# EAGLE design stm32f0driver1 (EAGLE 6.5.0)
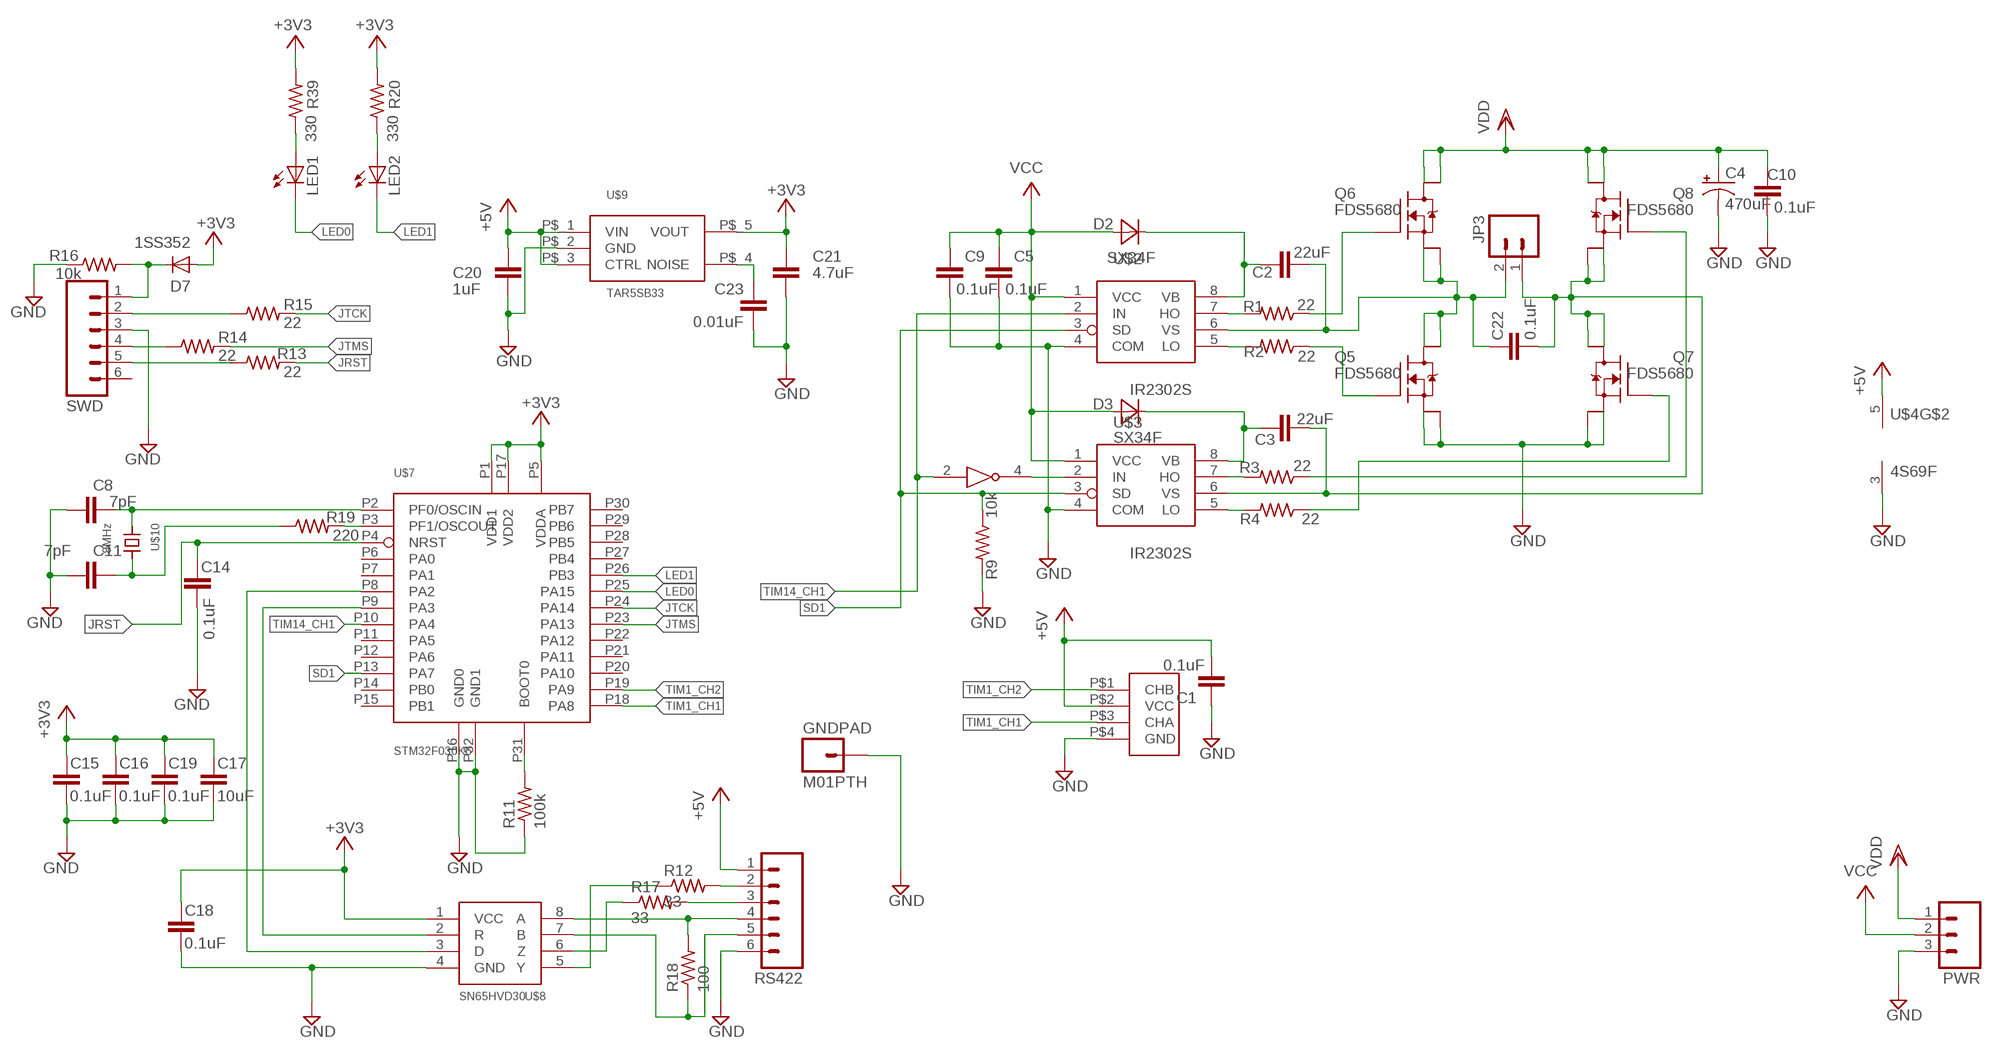
[diagram p0: schematic, sheet 1]

## Parts
C1  0.1uF  C-EUC0603  [C0603]
C2  22uF  C-EUC3225  [C3225]
C3  22uF  C-EUC3225  [C3225]
C4  470uF  CPOL-USE5-10.5  [E5-10,5]
C5  0.1uF  C-EUC0603  [C0603]
C8  7pF  C-EUC0603  [C0603]
C9  0.1uF  C-EUC0603  [C0603]
C10  0.1uF  C-EUC0603  [C0603]
C11  7pF  C-EUC0603  [C0603]
C14  0.1uF  C-EUC1608  [C1608]
C15  0.1uF  C-EUC1608  [C1608]
C16  0.1uF  C-EUC1608  [C1608]
C17  10uF  C-EUC3216  [C3216]
C18  0.1uF  C-EUC1608  [C1608]
C19  0.1uF  C-EUC1608  [C1608]
C20  1uF  C-EUC2012  [C2012]
C21  4.7uF  C-EUC2012  [C2012]
C22  0.1uF  C-EUC0603  [C0603]
C23  0.01uF  C-EUC0603  [C0603]
D2  SX34F  MBRA340T3  [SMA]
D3  SX34F  MBRA340T3  [SMA]
D7  1SS352  DIODESOD  [SOD-323]
GNDPAD  M01PTH  [1X01]
JP3  M02PTH3  [1X02_LONGPADS]
LED1  LED0603  [LED-0603]
LED2  LED0603  [LED-0603]
PWR  M03LONGPADS  [1X03_LONGPADS]
Q5  FDS5680  [1206-8CHIP-FET]
Q6  FDS5680  [1206-8CHIP-FET]
Q7  FDS5680  [1206-8CHIP-FET]
Q8  FDS5680  [1206-8CHIP-FET]
R1  22  R-US_R0603  [R0603]
R2  22  R-US_R0603  [R0603]
R3  22  R-US_R0603  [R0603]
R4  22  R-US_R0603  [R0603]
R9  10k  R-US_R0603  [R0603]
R11  100k  R-US_R0603  [R0603]
R12  33  R-US_R0603  [R0603]
R13  22  R-US_R0603  [R0603]
R14  22  R-US_R0603  [R0603]
R15  22  R-US_R0603  [R0603]
R16  10k  R-US_R0603  [R0603]
R17  33  R-US_R0603  [R0603]
R18  100  R-US_R0603  [R0603]
R19  220  R-US_R0603  [R0603]
R20  330  R-US_R0603  [R0603]
R39  330  R-US_R0603  [R0603]
RS422  M06SIP  [1X06]
SWD  M06SIP  [1X06]
U$1  HEDS9701-C54  [HEDS9701]
U$2  IR2302S  [SO8]
U$3  IR2302S  [SO8]
U$4  4S69F  [SOT23-5]
U$7  STM32F030K6  [LQFP32]
U$8  SN65HVD30  [SO8]
U$9  TAR5SB33  [TAR5SB33]
U$10  8MHz  NX5032GA  [SMD5032]

## Nets
+3V3: C15.1 C16.1 C17.1 C18.1 C19.1 C21.1 D7.2(A) R20.2 R39.2 U$7.P1(VDD1) U$7.P5(VDDA) U$7.P17(VDD2) U$8.1(VCC) U$9.P$_5(VOUT)
+5V: C1.2 C20.1 RS422.1 U$1.P$2(VCC) U$4.5(V+) U$9.P$_1(VIN) U$9.P$_3(CTRL)
GND: C1.1 C4.- C5.2 C8.2 C9.2 C10.2 C11.2 C14.2 C15.2 C16.2 C17.2 C18.2 C19.2 C20.2 C21.2 C23.2 GNDPAD.1 PWR.3 Q5.1(S) Q5.2(S1) Q5.3(S2) Q7.1(S) Q7.2(S1) Q7.3(S2) R9.2 R11.1 R16.1 RS422.6 SWD.3 U$1.P$4(GND) U$2.4(COM) U$3.4(COM) U$4.3(V-) U$7.P16(GND0) U$7.P32(GND1) U$8.4(GND) U$9.P$_2(GND)
JRST: C14.1 R13.2 U$7.P4(NRST)
JTCK: R15.2 U$7.P24(PA14)
JTMS: R14.2 U$7.P23(PA13)
LED0: LED1.C U$7.P25(PA15)
LED1: LED2.C U$7.P26(PB3)
N$2: C3.1 D3.C U$3.8(VB)
N$4: C3.2 C22.2 JP3.1 Q7.5(D) Q7.6(D1) Q7.7(D2) Q7.8(D3) Q8.1(S) Q8.2(S1) Q8.3(S2) U$3.6(VS)
N$8: C2.2 C22.1 JP3.2 Q5.5(D) Q5.6(D1) Q5.7(D2) Q5.8(D3) Q6.1(S) Q6.2(S1) Q6.3(S2) U$2.6(VS)
N$9: C2.1 D2.C U$2.8(VB)
N$12: R1.2 U$2.7(HO)
N$20: R19.2 U$7.P3(PF1/OSCOUT)
N$21: LED1.A R39.1
N$23: R2.2 U$2.5(LO)
N$24: R3.2 U$3.7(HO)
N$25: R4.2 U$3.5(LO)
N$26: Q6.4(G) R1.1
N$27: Q8.4(G) R3.1
N$28: C11.1 R19.1 U$10.P2
N$29: Q7.4(G) R4.1
N$30: C8.1 U$7.P2(PF0/OSCIN) U$10.P1
N$31: D7.1(C) R16.2 SWD.1
N$32: LED2.A R20.1
N$33: U$3.2(IN) U$4.4
N$35: C23.1 U$9.P$_4(NOISE)
N$36: Q5.4(G) R2.1
N$38: R11.2 U$7.P31(BOOT0)
N$39: R15.1 SWD.2
N$40: R14.1 SWD.4
N$41: R13.1 SWD.5
N$43: R12.2 RS422.2
N$44: R17.2 RS422.3
N$45: R12.1 U$8.5(Y)
N$46: R18.2 RS422.4 U$8.8(A)
N$47: R18.1 RS422.5 U$8.7(B)
N$48: R17.1 U$8.6(Z)
N$50: U$7.P8(PA2) U$8.3(D)
N$51: U$7.P9(PA3) U$8.2(R)
SD1: R9.1 U$2.3(SD) U$3.3(SD) U$7.P13(PA7)
TIM1_CH1: U$1.P$3(CHA) U$7.P18(PA8)
TIM1_CH2: U$1.P$1(CHB) U$7.P19(PA9)
TIM14_CH1: U$2.2(IN) U$4.2 U$7.P10(PA4)
VCC: C5.1 C9.1 D2.A D3.A PWR.2 U$2.1(VCC) U$3.1(VCC)
VDD: C4.+ C10.1 PWR.1 Q6.5(D) Q6.6(D1) Q6.7(D2) Q6.8(D3) Q8.5(D) Q8.6(D1) Q8.7(D2) Q8.8(D3)
Unconnected: SWD.6 U$7.P6(PA0) U$7.P7(PA1) U$7.P11(PA5) U$7.P12(PA6) U$7.P14(PB0) U$7.P15(PB1) U$7.P20(PA10) U$7.P21(PA11) U$7.P22(PA12) U$7.P27(PB4) U$7.P28(PB5) U$7.P29(PB6) U$7.P30(PB7)

## Library data of the parts
C1-C3 C5 C8-C11 C14-C23 = rcl:C-EU: CAPACITOR, European symbol
C4 = rcl:CPOL-US: POLARIZED CAPACITOR, American symbol
D2 D3 = diode:MBRA340T3: Surface Mount Schottky Power Rectifier Source: http://www.onsemi.com/pub_link/Collateral/MBRA340T3-D.PDF
D7 = SparkFun:DIODE: Diode These are standard reverse protection diodes and small signal diodes. SMA package can handle up to about 1A. SOD-323 can handle about 200mA. What the SOD-323 package when ordering, there are some mfgs out there that are 5-pin packages.
GNDPAD = SparkFun:M01: Header 1 Standard 1-pin 0.1" header. Use with straight break away headers (SKU : PRT-00116), right angle break away headers (PRT-00553), swiss pins (PRT-00743), machine pins (PRT-00117), and female headers (PRT-00115).
JP3 = SparkFun:M02: Header 2 Standard 2-pin 0.1" header. Use with straight break away headers (SKU : PRT-00116), right angle break away headers (PRT-00553), swiss pins (PRT-00743), machine pins (PRT-00117), and female headers (PRT-00115). Molex polarized connector foot print use with SKU : PRT-08233 with associated crimp pins and housings.
LED1 LED2 = SparkFun:LED: LEDs Standard schematic elements and footprints for 5mm, 3mm, 1206, and 0603 sized LEDs. 5mm - Spark Fun Electronics SKU : COM-00529 (and others)
PWR = SparkFun:M03: Header 3 Standard 3-pin 0.1" header. Use with straight break away headers (SKU : PRT-00116), right angle break away headers (PRT-00553), swiss pins (PRT-00743), machine pins (PRT-00117), and female headers (PRT-00115). Molex polarized connector foot print use with SKU : PRT-08232 with associated crimp pins and housings.
Q5-Q8 = mizdevice:FDS5680: Single N-Channel 30-V (D-S) MOSFET Source: http://akizukidenshi.com/download/fds5680.pdf
R1-R4 R9 R11-R20 R39 = rcl:R-US_: RESISTOR, American symbol
RS422 SWD = SparkFun:M06: Header 6 Standard 6-pin 0.1" header. Use with straight break away headers (SKU : PRT-00116), right angle break away headers (PRT-00553), swiss pins (PRT-00743), machine pins (PRT-00117), and female headers (PRT-00115). Molex polarized connector foot print use with SKU : PRT-08094 with associated crimp pins and housings. NOTES ON THE VARIANTS LOCK and LOCK_LONGPADS... This footprint was designed to help hold the alignment of a through-hole component (i.e. 6-pin header) while soldering it into place. You may notice that each hole has been shifted either up or down by 0.005 of an inch from it's more standard position (which is a perfectly straight line). This slight alteration caused the pins (the squares in the middle) to touch the edges of the holes. Because they are alternating, it causes a "brace" to hold the component in place. 0.005 has proven to be the perfect amount of "off-center" position when using our standard breakaway headers. Although looks a little odd when you look at the bare footprint, once you have a header in there, the alteration is very hard to notice. Also, if you push a header all the way into place, it is covered up entirely on the bottom side. This idea of altering the position of holes to aid alignment will be further integrated into the Sparkfun Library for other footprints. It can help hold any component with 3 or more connection pins.
U$1 = mizdevice:HEDS9701-C54: Avago Technology HEDS-9701 2ch Optical Encorder #C54 CPR100
U$2 U$3 = mizdevice:IR2302S: IR2302 Half Bridge Driver
U$4 = mizdevice:4S69F
U$7 = mizdevice:STM32F030K6: STMicro ARM Cortex-M0 Microcontroller STM32F030 LQFP32Pin
U$8 = mizdevice:SN65HVD30
U$9 = mizdevice:TAR5SB33: Toshiba TAR5SB33 3.3V Lowdrop Reg
U$10 = mizdevice:NX5032GA: NDK Crystal Units NX5032GA SMD5.0x 3.2mm

## Board
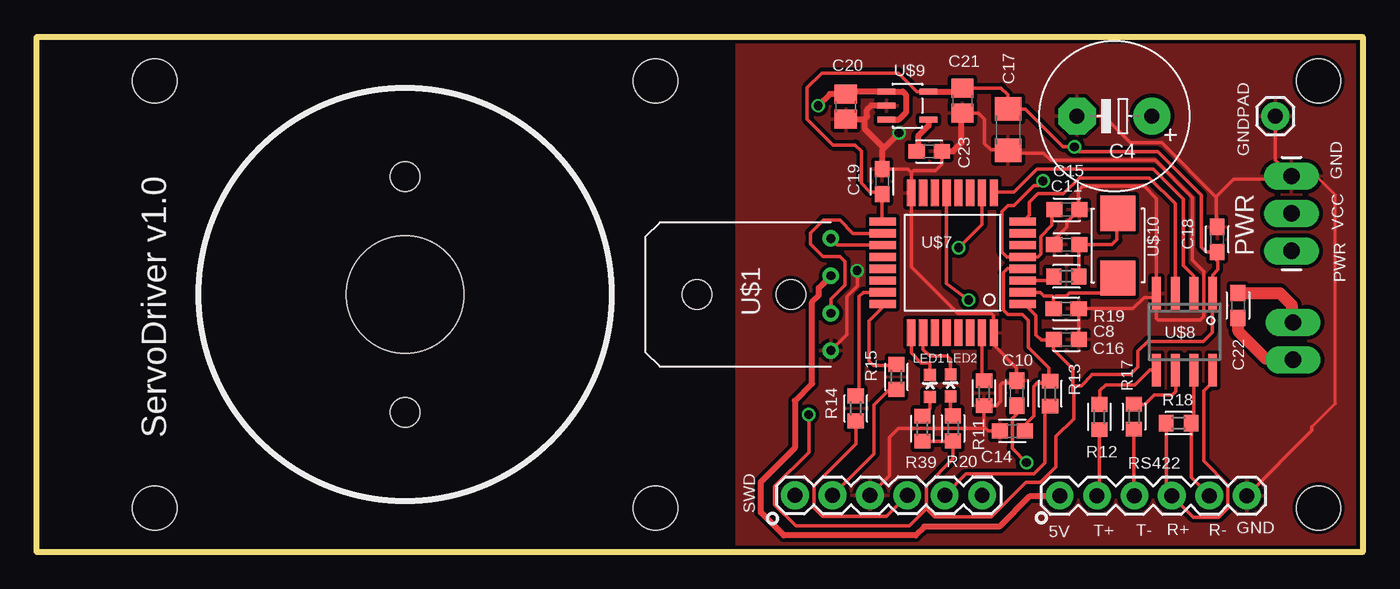
[diagram p1: board, top side]
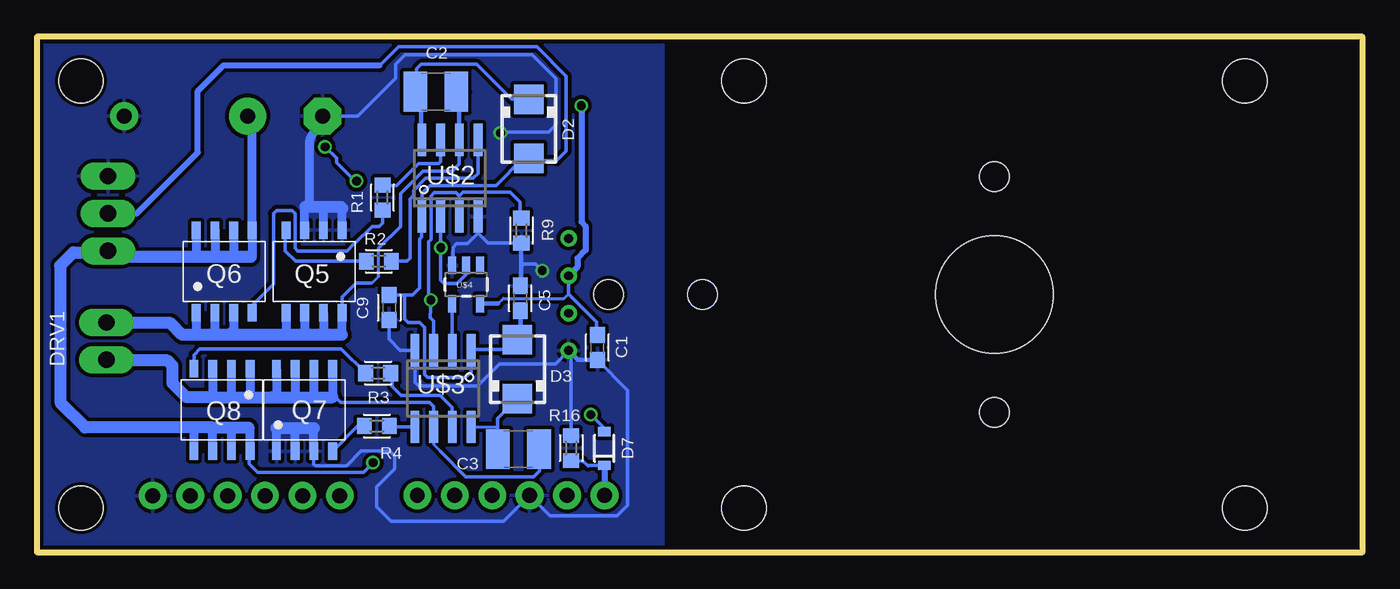
[diagram p2: board, bottom side, seen from below]

Size 90 x 35 mm. Coordinates in mm from the lower left corner, seen from the top.
Outline: 0,0 0,35 90,35 90,0 0,0
Copper layers (1*16): Top 0.035mm / dielectric 1.5mm / Bottom 0.035mm
Design rules "Fusion_eagle_rule_v1.1": minimum track width 6mil, minimum drill 12mil, track to track 6mil, track to pad 6mil, pad to pad 6mil, via to via 6mil, smd to smd 0mil, copper to edge 10mil, drill to drill 10mil, minimum pad ring 10mil, minimum via ring 6mil, stop-mask expansion 2mil, vias tented up to drill 100mil, thermal gap 10mil
Holes 3 mm at 8,3 87,3 87,32 8,32 42,32 42,3
Holes 8 mm at 25,17.5
Holes 2 mm at 25,25.5 25,9.5

### Footprints (pad centres in the part's own frame; a part is rotated, then mirrored left to right if it is on the bottom)
C0603 = smd 1.1 x 1: 1 -0.85,0; 2 0.85,0
C3225 = smd 1.6 x 2.7: 1 -1.4,0; 2 1.4,0
E5-10,5 = drill 1.016 pad 2.54: + -2.54,0 | drill 1.016 pad 2.54 octagon: - 2.54,0
C1608 = smd 1.1 x 1: 1 -0.85,0; 2 0.85,0
C3216 = smd 1.6 x 1.8: 1 -1.4,0; 2 1.4,0
C2012 = smd 1.3 x 1.5: 1 -0.85,0; 2 0.85,0
SMA = smd 2 x 2: A 2,0; C -2,0
SOD-323 = smd 0.63 x 0.83: 1 -1.15,0; 2 1.15,0
1X01 = drill 1.016 pad 1.88: 1 0,0
1X02_LONGPADS = drill 1.118 pad 1.88 long: 1 0,0; 2 2.54,0
LED-0603 = smd 0.8 x 0.8: A 0,-0.75; C 0,0.75
1X03_LONGPADS = drill 1.118 pad 1.88 long: 1 0,0; 2 2.54,0; 3 5.08,0
1206-8CHIP-FET = smd 0.6 x 1.2: 1 -1.905,-2.8; 2 -0.635,-2.8; 3 0.635,-2.8; 4 1.905,-2.8; 5 1.905,2.8; 6 0.635,2.8; 7 -0.635,2.8; 8 -1.905,2.8
R0603 = smd 1 x 1.1: 1 -0.85,0; 2 0.85,0
1X06 = drill 1.016 pad 1.88: 1 0,0; 2 2.54,0; 3 5.08,0; 4 7.62,0; 5 10.16,0; 6 12.7,0
HEDS9701 = drill 0.6: P$1 9.1,3.81; P$2 9.1,1.27; P$3 9.1,-1.27; P$4 9.1,-3.81 | hole 2: 0,0; 6.4,0
SO8 = smd 0.6 x 2.2: 1 -1.905,-2.6; 2 -0.635,-2.6; 3 0.635,-2.6; 4 1.905,-2.6; 5 1.905,2.6; 6 0.635,2.6; 7 -0.635,2.6; 8 -1.905,2.6
SOT23-5 = smd 0.55 x 1.2: 1 -0.95,-1.3; 2 0,-1.3; 3 0.95,-1.3; 4 0.95,1.3; 5 -0.95,1.3
LQFP32 = smd 0.56 x 1.8: P1 -2.8,-4.75; P2 -2,-4.75; P3 -1.2,-4.75; P4 -0.4,-4.75; P5 0.4,-4.75; P6 1.2,-4.75; P7 2,-4.75; P8 2.8,-4.75; P17 2.8,4.75; P18 2,4.75; P19 1.2,4.75; P20 0.4,4.75; P21 -0.4,4.75; P22 -1.2,4.75; P23 -2,4.75; P24 -2.8,4.75 | smd 1.8 x 0.56: P9 4.75,-2.8; P10 4.75,-2; P11 4.75,-1.2; P12 4.75,-0.4; P13 4.75,0.4; P14 4.75,1.2; P15 4.75,2; P16 4.75,2.8; P25 -4.75,2.8; P26 -4.75,2; P27 -4.75,1.2; P28 -4.75,0.4; P29 -4.75,-0.4; P30 -4.75,-1.2; P31 -4.75,-2; P32 -4.75,-2.8
TAR5SB33 = smd 1.2 x 0.4: P$_1 -1.425,0.95; P$_2 -1.425,0; P$_3 -1.425,-0.95; P$_4 1.425,-0.95; P$_5 1.425,0.95
SMD5032 = smd 2.4 x 2.4: P1 2.2,0; P2 -2.2,0

### Placement (x,y rotation side)
C1  51.94,13.9 90 bottom
C2  62.91,31.28 0 bottom
C3  57.31,7 0 bottom
C4  73.15,29.61 180 top
C5  57.18,17.24 90 bottom
C8  69.87,16.54 0 top
C9  66.08,16.61 270 bottom
C10  66.53,10.8 90 top
C11  69.91,20.89 180 top
C14  66.22,8.23 180 top
C15  69.92,23.26 0 top
C16  69.88,14.44 0 top
C17  65.93,28.69 270 top
C18  80.12,21.24 90 top
C19  57.38,25.17 90 top
C20  54.91,30.25 270 top
C21  62.83,30.67 270 top
C22  81.53,16.75 270 top
C23  60.58,27.22 0 top
D2  56.61,28.75 270 bottom
D3  57.37,12.42 90 bottom
D7  51.48,7.04 90 bottom
GNDPAD  84.07,29.61 0 top
JP3  85.27,13.06 90 bottom
LED1  60.63,11.29 0 top
LED2  62.03,11.32 0 top
PWR  85.17,20.46 90 top
Q5  71.18,19.06 180 bottom
Q6  77.28,19.06 0 bottom
Q7  71.83,9.66 0 bottom
Q8  77.43,9.66 180 bottom
R1  66.53,24.08 90 bottom
R2  66.78,19.76 0 bottom
R3  66.83,12.16 0 bottom
R4  66.92,8.57 0 bottom
R9  57.11,21.84 270 bottom
R11  64.3,10.8 90 top
R12  72.12,9.18 270 top
R13  68.79,10.76 90 top
R14  55.59,9.76 90 top
R15  58.35,11.9 90 top
R16  53.73,7.06 270 bottom
R17  74.47,9.2 270 top
R18  77.51,8.76 180 top
R19  69.89,18.73 180 top
R20  62.19,8.41 270 top
R39  60.11,8.39 270 top
RS422  69.43,3.84 0 top
SWD  51.47,3.86 0 top
U$1  44.8,17.5 0 top
U$2  61.96,25.39 0 bottom
U$3  62.43,11.11 180 bottom
U$4  60.85,18.18 180 bottom
U$7  62.16,19.65 90 top
U$8  77.91,14.97 180 top
U$9  59.1,30.33 0 top
U$10  73.38,20.82 270 top

### Tracks (layer width: path | path; a pad name or v marks a point on that pad's centre or on a via)
+3V3  (via drill 0.6)
  Top 0.254: U$7.P1 67.04,16.85 67.83,16.06 67.83,14.76 68.18,14.41 69,14.41 C16.1 69.02,13.78 70.34,12.46 70.34,11.28 | C15.1 68.9,23.09 68.9,22.2 68.15,21.45 68.15,20.24 67.96,20.05 U$7.P5 65.84,20.05 65.52,20.37 65.52,23.14 65.92,23.54 66.33,23.54 67.69,24.9 67.99,24.9 v68.3,25.21 68.28,25.19 | C21.1 65.45,31.52 65.9,31.07 65.9,30.12 C17.1 67.11,30.09 69.65,27.55 70.41,27.55 v70.44,27.52 70.76,27.2 76.09,27.2 79.05,24.24 79.05,20.73 79.39,20.39 C18.1 80.03,19.86 80.16,19.73 80.16,19.18 79.81,18.84 U$8.1 79.78,17.54 79.78,14.91 79.18,14.31 75.4,14.31 74.74,13.65 74.74,12.58 74.22,12.06 71.63,12.06 71.63,12.02 70.89,11.28 70.34,11.28 | U$9.P$_5 59.75,31.28 58.49,32.54 53.3,32.54 52.29,31.53 52.29,29.42 54.05,27.66 55.54,27.66 55.96,27.24 55.96,25.06 56.56,24.46 57.24,24.46 C19.1 | 57.23,24.47 C19.1 | C19.1 57.38,22.48 U$7.P17 | R39.2 62.17,7.54 R20.2 62.19,6.32 60.39,4.52 60.39,2.95 | 70.34,11.28 70.34,10.85 70.38,10.81 70.38,9.06 69.18,7.86 69.18,5.8 68.11,4.73 67.13,4.73 64.81,2.41 60.93,2.41 60.39,2.95 | 60.39,2.95 59.23,1.79 51.52,1.79 50.08,3.23 50.08,4.47 52.4,6.79 v52.4,9.34
  Top 0.406: U$9.P$_5 62.59,31.28 C21.1
  Bottom 0.254: 51.48,8.21 51.48,8.42 v52.4,9.34 | v68.3,25.21 68.4,25.21 69.64,26.45 69.64,26.77 v70.44,27.52
  Bottom 0.305: D7.2 51.48,8.21
+5V  (via drill 0.6)
  Top 0.254: C20.1
  Top 0.406: RS422.1 69.43,3.78 67.38,3.78 65.33,1.73 60.25,1.73 59.65,1.13 50.71,1.13 49.14,2.7 49.14,4.76 51.46,7.08 51.46,10.28 52.63,11.45 52.63,16.99 53.08,17.44 53.08,17.95 U$1.P$2 | C20.1 53.83,31.11 v53.04,30.32 | C20.1 55.09,31.28 U$9.P$_1 58.79,31.28 58.99,31.08 58.99,29.84 58.53,29.38 U$9.P$_3
  Bottom 0.2: 58.7,16.88 58.68,16.88 58.32,17.24 54.2,17.24 53.9,17.54
  Bottom 0.254: U$1.P$2 53.9,17.54 52,15.64 52,14.81 C1.2
  Bottom 0.305: U$4.5 58.7,16.88
  Bottom 0.406: v53.04,30.32 53.04,22.44 52.74,22.14 52.74,20.51 53.3,19.95 53.3,19.37 U$1.P$2
GND  (via drill 0.6)
  Top 0.2: 86.55,8.5 88.15,10.1 88.15,24.25 87.02,25.39 85.33,25.39 PWR.3
  Top 0.254: C16.2 C8.2 74.4,16.54 75.17,17.31 75.75,17.31 U$8.4 | C11.2 69.06,21.23 69.92,22.09 69.92,22.41 C15.2 70.7,23.33 70.7,24.54 71.01,24.85 75.17,24.85 76,24.02 U$8.4 | 54.97,29.46 C20.2 | C21.2 63.91,29.82 64.33,29.4 64.33,27.75 64.75,27.33 65.89,27.33 C17.2 66.12,27.1 68.34,27.1 68.83,26.61 75.91,26.61 78.43,24.09 78.43,19.83 79.21,19.05 79.21,16.01 78.98,15.78 76.11,15.78 76,15.88 U$8.4 | 57.41,26.05 C19.2 59.12,26.01 59.36,25.77 | 59.36,25.77 U$7.P16 59.36,19.37 62.52,16.21 64.79,16.21 64.92,16.08 64.92,14.94 U$7.P32 64.96,14.06 66.51,12.51 66.51,11.67 C10.2 66.38,11.5 65.55,11.5 65.4,11.35 65.4,10.23 65.12,9.95 R11.1 64.29,8.52 | C23.2 61.43,26.35 61.01,25.93 59.52,25.93 59.36,25.77 | 86.55,8.5 86.55,8.26 RS422.6 | 80.03,22.18 C18.2 80.08,22.13 80.08,24.07 | C4.- 72.43,29.61 74.24,27.8 76.35,27.8 80.08,24.07 | 80.08,24.07 80.08,24.14 81.26,25.32 84.95,25.32 PWR.3 84.07,26.64 GNDPAD.1 | v55.69,19.12 55.69,18.08 54.98,17.37 54.98,14.77 U$1.P$4 | SWD.3 57.86,5.17 57.86,7.81 58.47,8.42 64.19,8.42 64.29,8.52 | C14.2 64.58,8.23 64.29,8.52
  Top 0.305: 85.19,25.56 PWR.3
  Top 0.406: C20.2 56.18,29.4 | U$9.P$_2 56.65,30.33 56.36,30.04 56.36,29.58 56.18,29.4 | 57.41,26.05 57.41,27.35 57.51,27.45 | 57.51,27.45 v58.53,28.47 | 56.18,29.4 56.18,28.78 57.51,27.45 | C23.2 62.19,27.22 62.77,27.8 62.77,29.76 C21.2
  Bottom 0.254: U$3.4 64.48,13.71 | U$2.4 60.05,21.66 | 60.05,21.66 60.77,20.95 61.49,20.95 61.74,20.7 61.74,19.54 U$4.3 | U$3.4 65.34,13.71 66.1,14.47 66.1,15.74 C9.2 | 57.14,20.96 R9.2 59.38,20.99 60.05,21.66 | U$3.4 64.33,11.53 64.1,11.29 60.08,11.29 58.58,12.79 54.8,12.79 U$1.P$4 53.73,13.52 R16.1 | Q7.3 71.19,5.97 71.08,5.86 68.98,5.86 67.97,6.87 66.06,6.87 65.72,6.53 65.72,5.66 66.93,4.45 66.93,3.08 65.94,2.09 58.32,2.09 56.59,3.82 56.55,3.82 SWD.3 55.16,2.47 50.6,2.47 49.89,3.18 49.89,11 C1.1 | 57,19.57 56.14,19.57 v55.69,19.12 | C4.- 68.22,29.61 65.65,32.18 65.65,33.15 65.01,33.79 56.38,33.79 54.74,32.15 54.74,29.05 55.27,28.52 58.48,28.52 v58.53,28.47
  Bottom 0.305: 85.33,25.39 PWR.3 | 57.14,20.96 57.14,19.43 | 57.14,19.43 57.14,18.13 C5.2 | 57,19.57 57.14,19.43 | C1.1 53.26,13.05 U$1.P$4
  Bottom 0.406: 72.47,8.39 72.48,8.41
  Bottom 0.61: Q7.2 72.47,8.39 | Q7.1 73.73,8.4 73.73,8.41 | Q5.1 69.28,23.36 | Q5.3 71.81,23.43 71.78,23.46 | Q5.2 70.55,23.27 70.73,23.46 | 71.63,23.46 71.48,23.61 71.48,27.97 C4.- | Q7.3 71.19,8.39 71.18,8.41
  Bottom 0.813: 71.18,8.41 72.48,8.41 73.73,8.41 | 71.78,23.46 71.63,23.46 70.73,23.46 69.38,23.46 69.28,23.36
  pour Top (isolate 0.254): 89.69,0.43 89.68,0.69 89.62,34.69 47.52,34.69 47.52,0.38 84.23,0.35 84.44,0.35
  pour Bottom (isolate 0.254): 89.02,0.34 89.66,0.34 89.65,34.68 47.51,34.68 47.51,0.35
JRST
  Top 0.254: U$7.P4 65.87,19.25 65.61,18.99 65.61,16.45 65.92,16.14 66.89,16.14 67.31,15.72 67.31,13.9 68.71,12.5 68.71,11.69 R13.2 68.67,11.49 67.89,11.49 67.67,11.27 67.67,9.26 67.07,8.66 C14.1
JTCK
  Top 0.254: 58.41,12.81 R15.2 58.27,12.67 56.79,12.67 56.49,12.97 56.49,15.69 57.41,16.61 U$7.P24
JTMS
  Top 0.254: U$7.P23 56.1,17.65 55.81,17.36 55.81,10.83 R14.2
LED0
  Top 0.254: U$7.P25 59.36,13.53 60.03,12.86 60.52,12.86 60.63,12.75 LED1.C
LED1
  Top 0.254: U$7.P26 60.16,13.78 60.61,13.33 61.79,13.33 62.01,13.11 62.01,12.09 LED2.C
N$2
  Bottom 0.2: U$3.8 58.75,8.51 C3.1
  Bottom 0.254: C3.1 58.71,9.08 D3.C
N$4
  Top 0.61: 85.34,13.13 JP3.1
  Top 0.813: 85.34,13.13 83.43,13.13 81.56,15 81.56,15.87 C22.2
  Bottom 0.2: U$3.6 63.06,7.32 62.58,6.83 | 55.87,6.83 55.65,7.05
  Bottom 0.254: 69.83,12.37 Q7.5 | 78.13,12.39 Q8.3 | U$3.6 63.06,9.89 63.33,10.16 69.38,10.16 69.92,10.71 | 62.58,6.83 60.88,5.13 56.27,5.13 55.87,5.53 55.87,6.83 55.91,6.87 C3.2
  Bottom 0.406: 78.06,10.68 78.23,10.51 | 76.8,10.68 76.63,10.51
  Bottom 0.61: Q8.3 78.06,10.68 | Q8.2 76.8,10.68 | Q8.1 75.53,10.71 75.73,10.51 | Q7.8 73.73,10.8 74.03,10.51 | Q7.7 72.47,10.57 72.53,10.51 | Q7.6 71.19,10.54 71.23,10.51 | Q7.5 69.92,10.71 69.92,10.52 69.93,10.51
  Bottom 0.813: 69.93,10.51 71.23,10.51 72.53,10.51 74.03,10.51 75.73,10.51 76.63,10.51 78.23,10.51 79.83,10.51 80.78,11.46 80.78,12.66 81.13,13.01 85.22,13.01 JP3.1
N$8
  Top 0.813: C22.1 84.38,17.6 85.18,16.8 85.18,15.69 JP3.2
  Bottom 0.2: 67.28,18.28 67.23,18.28 66.82,18.69 66.82,18.7 66.79,18.73 66.79,20.65
  Bottom 0.254: Q5.5 73.18,16.26 | 76.53,16.14 Q6.3 | 79.28,16.16 Q6.1 | U$2.6 61.33,26.34 61.78,25.89 63.77,25.89 65.32,24.34 65.32,22.12 66.79,20.65 | 67.28,18.28 68.31,18.28 69.27,17.32 Q5.8 | 60.82,31.27 C2.2
  Bottom 0.305: U$2.6 61.33,31.09 C2.2
  Bottom 0.61: 69.28,14.76 69.28,14.77 Q5.8 | Q6.1 79.19,14.86 79.28,14.76 | Q6.2 77.92,14.93 78.08,14.76 | Q6.3 76.64,15.14 77.03,14.76 | Q5.5 73.08,14.9 73.23,14.76 | Q5.6 71.81,14.78 71.83,14.76 | Q5.7 70.55,14.82 70.48,14.76
  Bottom 0.813: 69.28,14.76 70.48,14.76 71.83,14.76 73.23,14.76 77.03,14.76 78.08,14.76 79.28,14.76 80.13,14.76 80.93,15.56 85.23,15.56 JP3.2
N$9
  Bottom 0.254: 63.9,28.02 U$2.8 | D2.C 57.76,30.75 60.14,33.13 63.92,33.13 64.22,32.83 64.22,31.37 C2.1
  Bottom 0.305: 63.9,28.02 63.9,30.87 C2.1
N$12
  Bottom 0.254: U$2.7 62.59,26.52 62.72,26.39 64.08,26.39 65.59,24.88 66.48,24.88 R1.2
N$20
  Top 0.254: U$7.P3 68.76,18.45 R19.2
N$21
  Top 0.254: LED1.A 60.62,9.75 R39.1 59.8,9.06
N$23
  Bottom 0.254: U$2.5 60.05,25.71 60.38,25.39 63.6,25.39 64.42,24.57 64.42,24.24 64.67,23.99 64.67,19.99 64.88,19.78 65.91,19.78 R2.2
N$24
  Bottom 0.254: U$3.7 61.8,9.82 62.63,10.66 65.28,10.66 65.88,11.26 65.88,12.06 R3.2
N$25
  Bottom 0.254: U$3.5 66.01,8.51 R4.2
N$26
  Bottom 0.254: Q6.4 75.38,16.77 73.93,18.21 73.93,23.01 73.73,23.21 72.68,23.21 72.48,23.01 72.48,20.66 72.28,20.46 68.93,20.46 68.48,20.91 68.45,20.91 67.24,22.12 66.76,22.12 66.54,22.34 R1.1
N$27
  Bottom 0.254: R3.1 69.33,13.81 78.93,13.81 79.33,13.41 Q8.4
N$28
  Top 0.254: R19.1 70.74,20.87 C11.1 72.98,20.89 73.32,21.23 73.32,22.96 U$10.P2
N$29
  Bottom 0.254: Q7.4 68.22,8.57 R4.1
N$30
  Top 0.254: U$7.P2 68.13,17.65 68.37,17.41 68.94,17.41 69.02,17.33 C8.1 69.02,17.24 69.18,17.4 69.89,17.4 70.09,17.6 72.36,17.6 U$10.P1
N$31
  Bottom 0.254: R16.2 52.95,6.21 52.6,5.86 52.57,5.89 D7.1
  Bottom 0.406: D7.1 SWD.1
N$32
  Top 0.254: LED2.A 62.03,9.42 R20.1
N$33
  Bottom 0.254: U$3.2 U$4.4
N$35
  Top 0.406: U$9.P$_4 60.52,28.96 59.81,28.25 59.81,27.3 C23.1
N$36
  Bottom 0.254: R2.1 72.43,19.76 73.13,20.46 73.13,21.82 Q5.4
N$38
  Top 0.254: U$7.P31 64.16,11.79 R11.2
N$39
  Top 0.254: R15.1 57.89,11.05 56.84,10 56.84,6.69 SWD.2
N$40
  Top 0.254: R14.1 55.59,7.35 52.76,4.52 52.76,3.01 53.32,2.45 57.68,2.45 SWD.4
N$41
  Top 0.254: R13.1 68.44,9.56 68.44,6.06 67.69,5.31 63.08,5.31 SWD.5
N$43
  Top 0.254: R12.2 72.12,3.99 RS422.2
N$44
  Top 0.254: R17.2 74.47,3.88 RS422.3
N$45
  Top 0.254: U$8.5 75.55,12.37 74.54,11.36 72.56,11.36 72.17,10.97 72.17,10.08 R12.1
N$46
  Top 0.254: U$8.8 79.81,11.56 79.2,10.95 79.2,6.21 80.86,4.55 80.86,2.99 80.24,2.37 78.52,2.37 RS422.4 76.66,4.23 R18.2
N$47
  Top 0.254: U$8.7 78.55,8.95 R18.1 78.36,5.07 RS422.5
N$48
  Top 0.254: R17.1 75.23,10.05 75.85,10.67 77.07,10.67 77.32,10.92 77.32,12.32 U$8.6
N$50
  Top 0.254: U$7.P8 67.36,22.9 67.36,23.77 67.94,24.35 69.69,24.35 70.76,25.42 75.53,25.42 77.28,23.68 U$8.3
N$51
  Top 0.254: U$8.2 78.55,18.75 77.84,19.46 77.84,23.99 75.8,26.03 67.89,26.03 66.33,24.47 65.03,24.47 U$7.P9
SD1  (via drill 0.6)
  Top 0.254: U$7.P13 61.76,18.26 v63.25,17.13
  Bottom 0.254: U$2.3 61.33,24.2 | 61.33,24.2 61.07,24.45 57.88,24.45 57.19,23.76 57.19,22.77 R9.1 | 61.33,24.2 61.54,24.41 63.03,24.41 63.25,24.19 63.25,21.24 63.39,21.1 63.39,17.27 v63.25,17.13 63.3,15.94 63.07,15.71 U$3.3 63.08,13.72
TIM1_CH1
  Top 0.254: U$7.P18 55.41,21.65 54.5,22.56 53.39,22.56 52.5,21.67 52.5,20.93 53.35,20.08 54.53,20.08 54.87,19.74 54.87,18.14 53.92,17.19 53.92,16.25 U$1.P$3
TIM1_CH2
  Top 0.254: U$7.P19 54.36,20.85 U$1.P$1
TIM14_CH1  (via drill 0.6)
  Top 0.254: U$7.P10 64.16,22.26 v62.58,20.68
  Bottom 0.254: U$4.2 60.85,18.85 61.47,18.23 62.35,18.23 62.59,18.48 62.59,20.66 v62.58,20.68 62.58,22.77 U$2.2
VCC
  Bottom 0.254: U$3.1 | U$3.1 60.52,13.77 58.02,13.77 D3.A 58.01,15.06 | 64.98,17.46 64.49,17.46 64.02,17.93 64.02,21.26 63.87,21.41 U$2.1 63.85,22.8 63.85,24.38 63.32,24.91 58.83,24.91 56.99,26.75 D2.A 56.45,26.59 54.71,26.59 54.06,27.24 54.06,32.34 56.05,34.33 65.45,34.33 66.74,33.04 | 64.98,17.46 C9.1 | U$3.1 60.52,12.21 60.88,11.86 63.47,11.86 63.68,12.07 63.68,15.27 64.02,15.61 64.81,15.61 65.04,15.84 65.04,17.4 64.98,17.46
  Bottom 0.305: 60.48,13.66 U$3.1 | 56.53,26.67 D2.A | C5.1 57.18,14.61 D3.A
  Bottom 0.406: PWR.2 83.21,23 79.07,27.14 79.07,31.31 77.32,33.06 66.76,33.06 66.74,33.04
VDD  (via drill 0.6)
  Top 0.254: C10.1 66.53,9.39 66.21,9.07 66.21,7.05 v67.18,6.08
  Bottom 0.254: 77.88,21.82 Q6.7 | Q8.8 75.59,6.79 75.59,6 75.02,5.43 67.83,5.43 v67.18,6.08
  Bottom 0.305: 87.67,20.36 87.52,20.36 | 76.88,6.78 Q8.7 76.78,6.84 76.78,6.78
  Bottom 0.61: Q8.6 78.06,8.45 78.08,8.46 | Q8.5 79.33,8.4 79.28,8.46 | 75.48,20.06 75.38,20.16 Q6.5 75.38,29.3 C4.+ | 77.88,21.82 77.88,20.21 78.03,20.06 | Q6.6 76.64,20.12 76.58,20.06 | Q8.8 75.53,8.41 75.63,8.41 | 76.78,6.78 76.78,8.46 | Q6.8 79.19,20.11 79.13,20.06
  Bottom 0.813: 75.48,20.06 76.58,20.06 78.03,20.06 79.13,20.06 84.77,20.06 PWR.1 85.27,20.36 87.52,20.36 88.42,19.46 88.37,19.41 88.37,10.1 86.73,8.46 79.28,8.46 78.08,8.46 76.78,8.46 75.63,8.46 75.63,8.41

### Text on the board
tNames: ServoDriver v1.0 | GND | VCC | PWR | 5V | T+ | T- | R+ | R- | GND
bNames: DRV1